# EasyEDA Pro project 3轴6.1--esp32 -(0821).eprj, board PCB
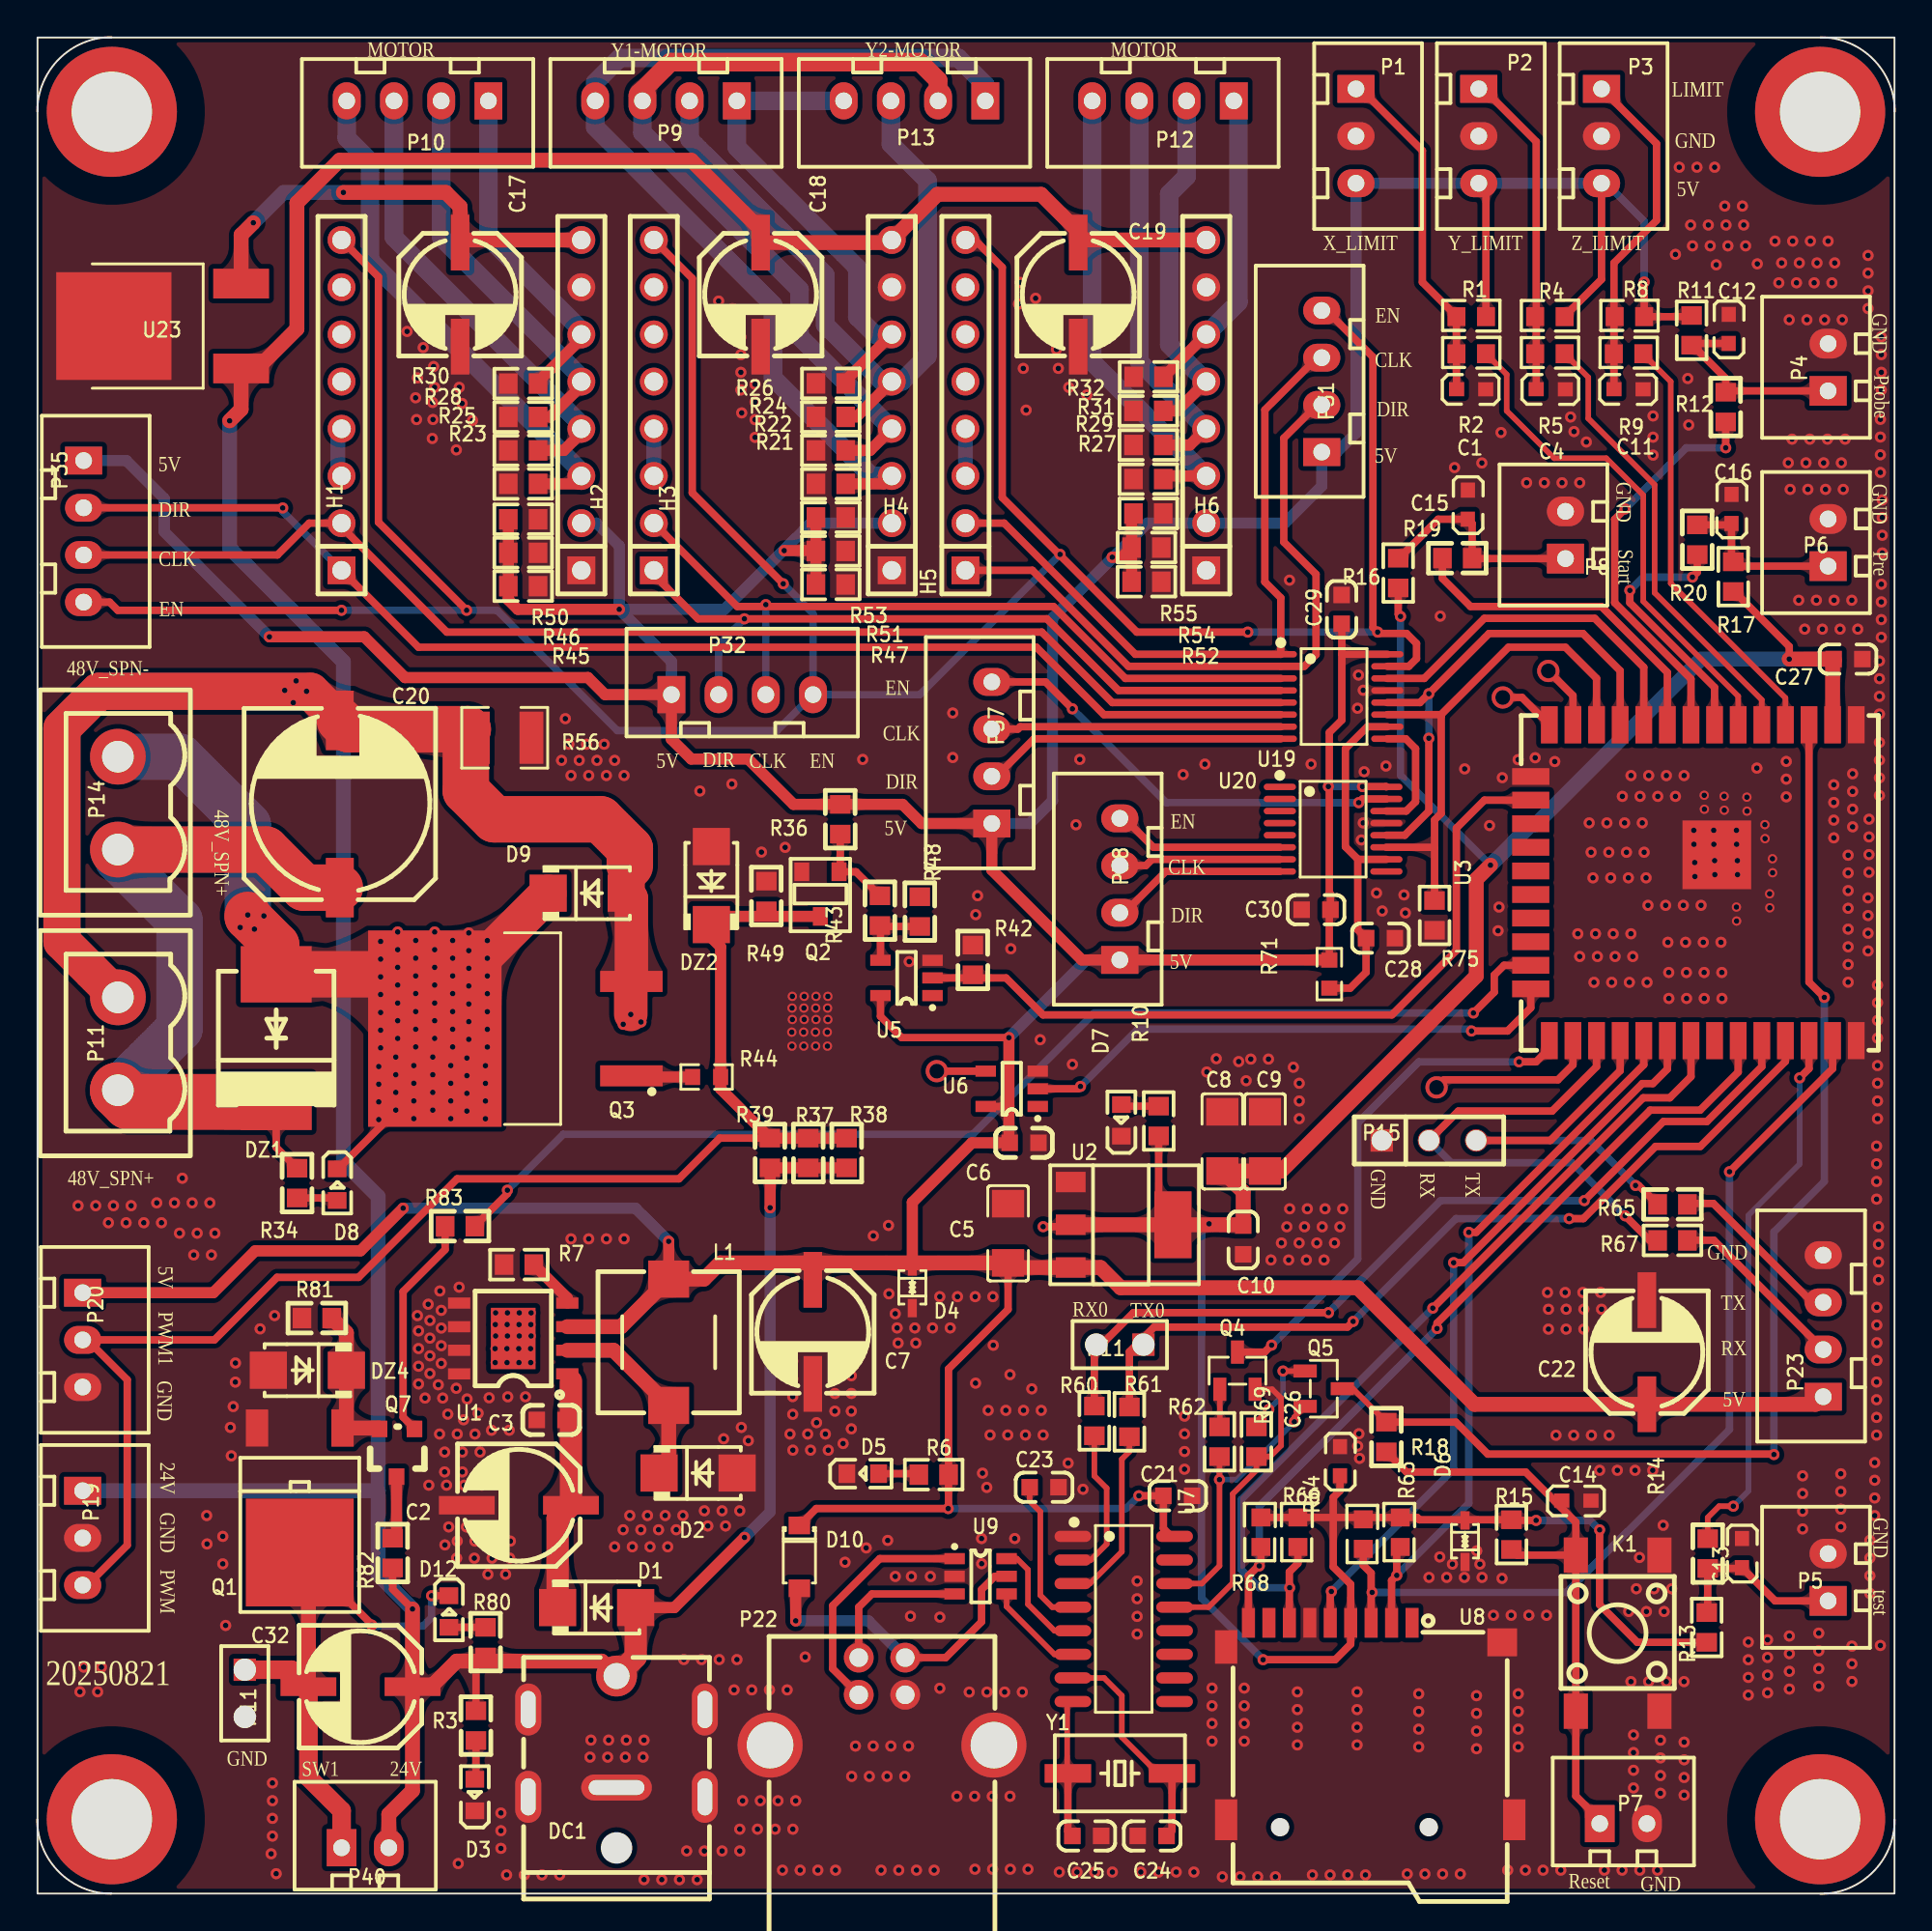
[diagram p1: board, top side]
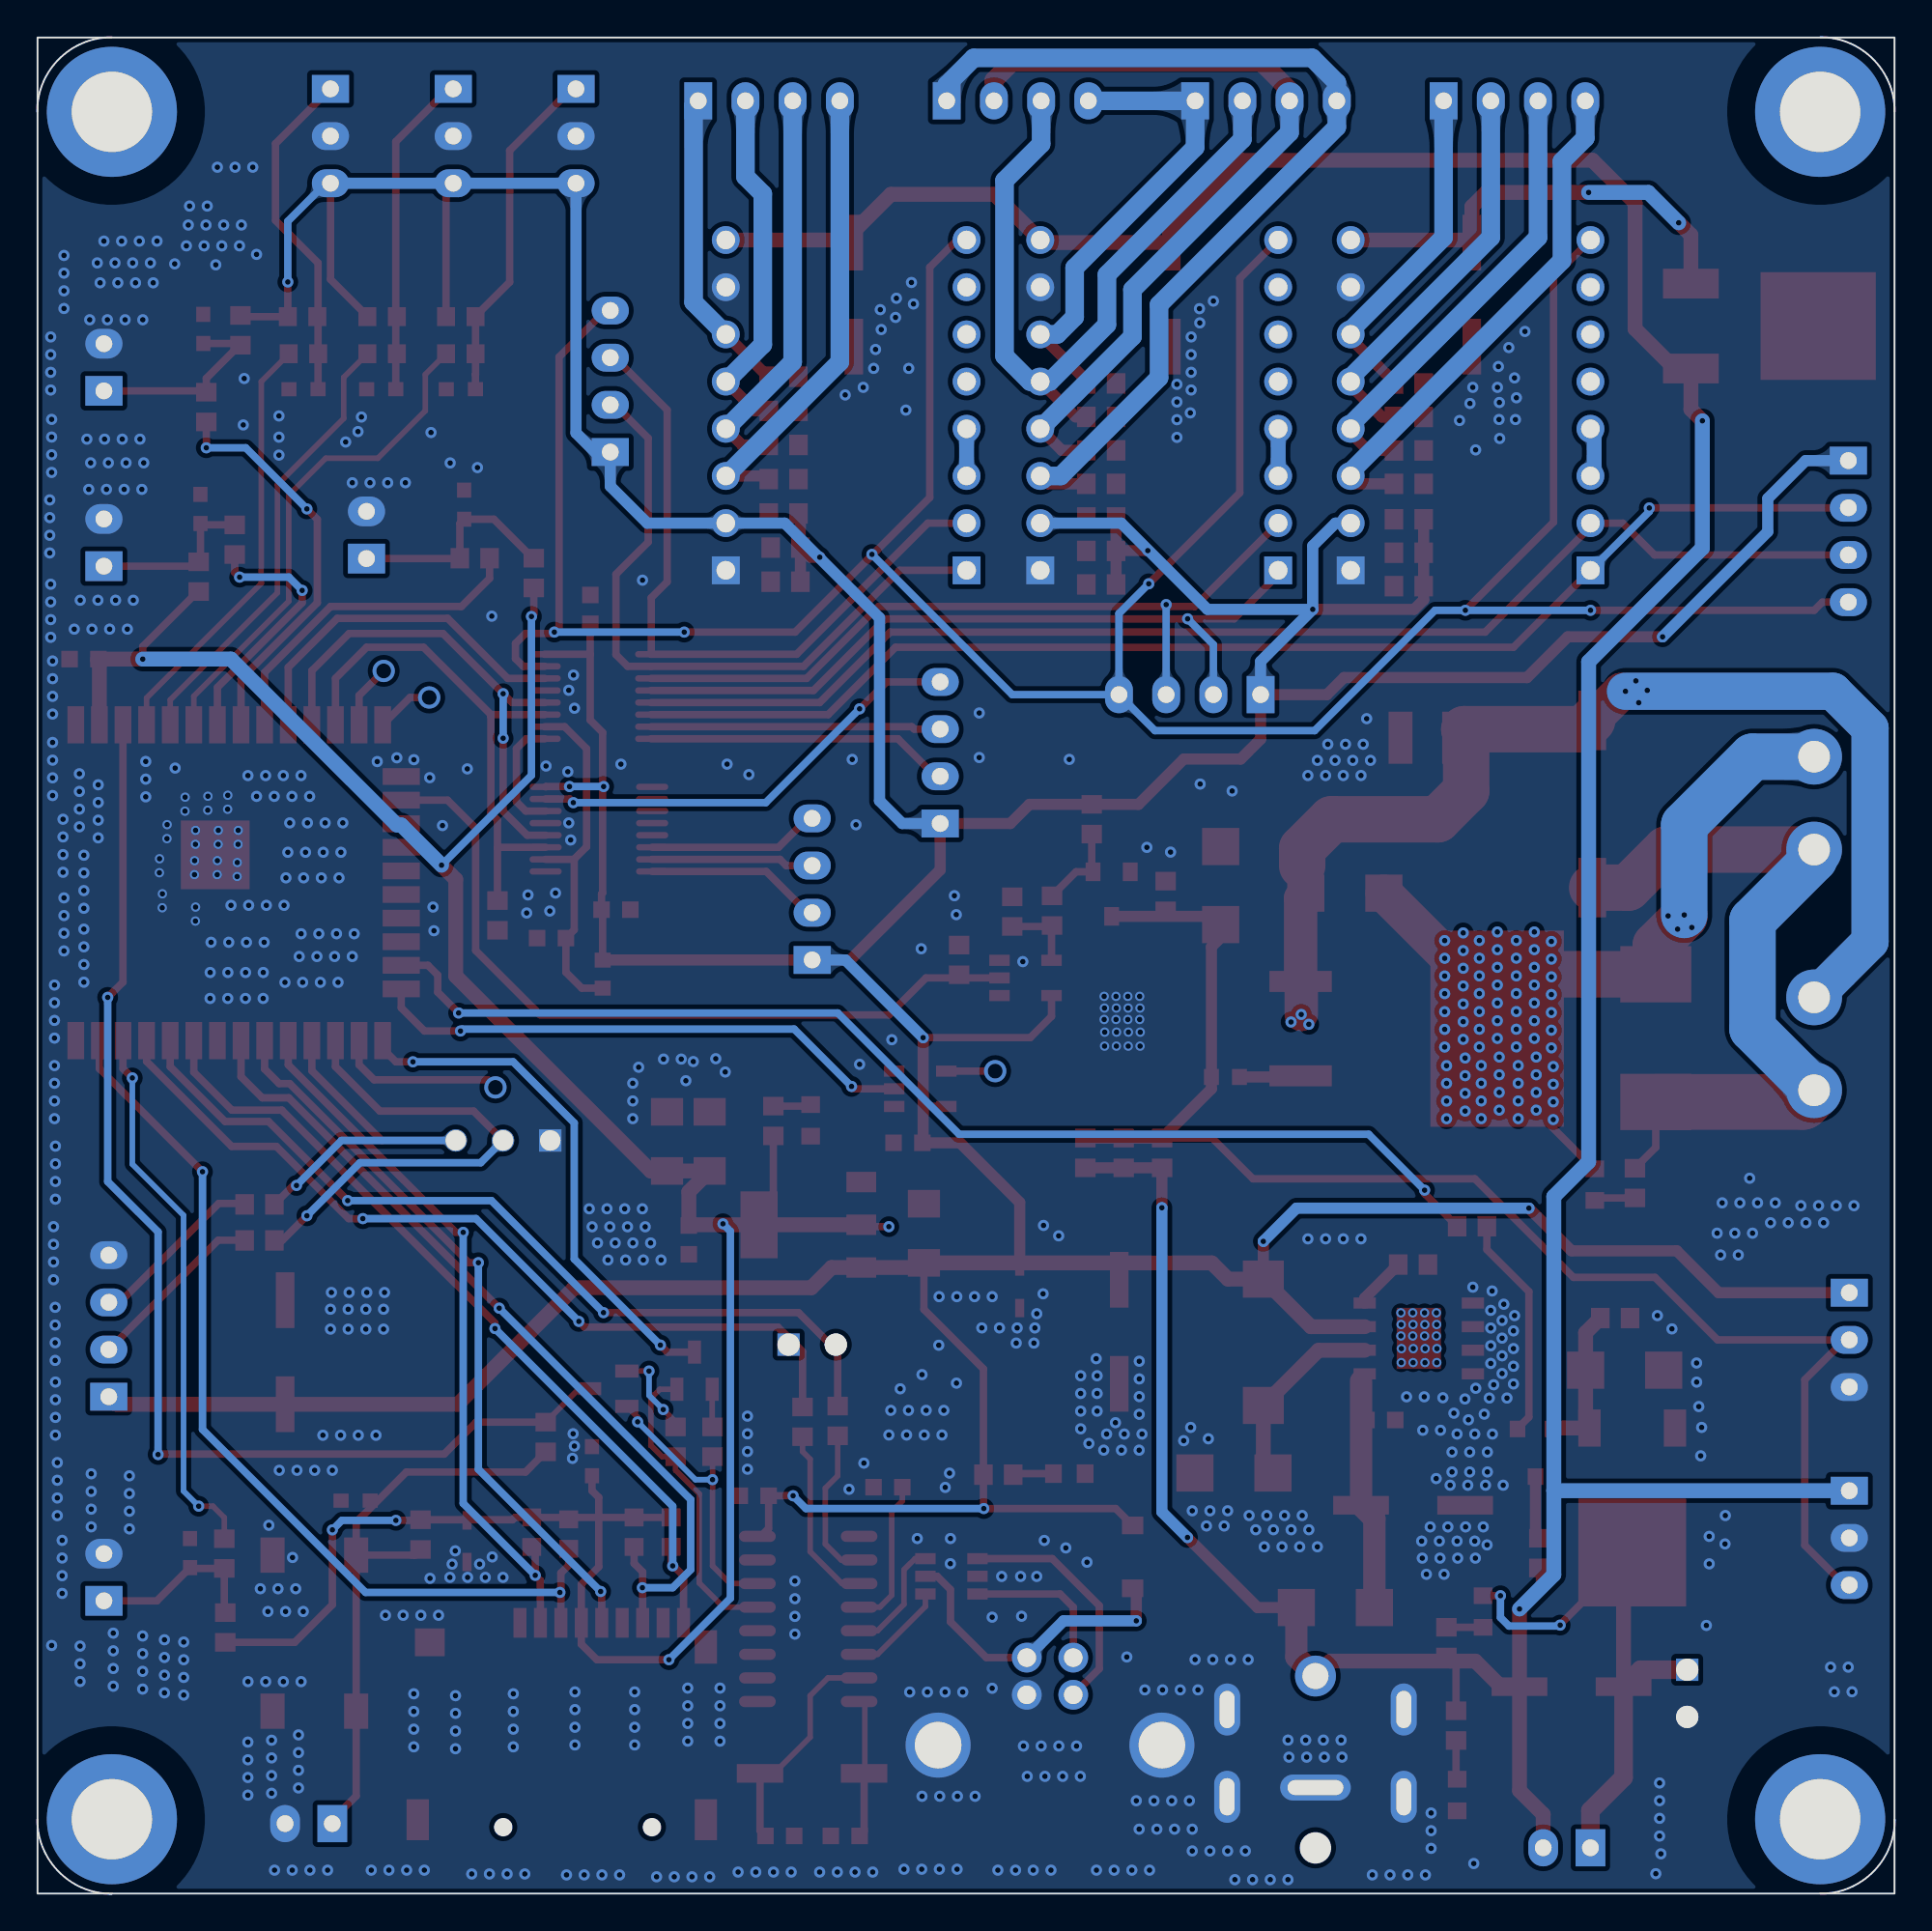
[diagram p2: board, bottom side, seen from below]

Outline 99.94 x 99.94 mm; copper layers: Top Layer, Bottom Layer. Coordinates in mm from the lower left corner of the outline.
Outline path: rectangle 0.02,99.92 99.92,0.02 ; 0.01,95.94 arc(1.18,98.77) 4.01,99.94 ; 4,0.01 arc(1.17,1.18) 0,4.01 ; 95.94,99.93 arc(98.77,98.76) 99.94,95.93 ; 99.93,4 arc(98.76,1.17) 95.93,0
Stack: Top Layer 0.035mm / Dielectric1 1.51mm FR4 er 4.5 / Bottom Layer 0.035mm

## Design rules (mm)
template: 用户自定义配置
spacing Default (default): track to track 0.152, other pairs 0 to 0.152
track width Default (default): min 0.254, default 0.254, max 25.4
differential pair differentialPair (default): width min 0.127, default 0.254, max 2.54; gap min 0.152, default 0.152
via Default (default): diameter min 0.25, default 0.61, max 100.025; hole min 0.2, default 0.305, max 59.995

## Placement (name value [footprint] x y rotation side)
C1  103  [11]  77.88 80.69 0 top
C2  100uF/35V  [电解电容贴片6X6]  25.91 20.92 180 top
C3  104  [0603C]  27.65 25.51 0 top
C4  103  [11]  82.17 80.69 0 top
C5  10uF  [C1206]  52.23 35.55 90 top
C6  104  [0603C]  53.09 40.42 180 top
C7  100uF/35V  [电解电容贴片6X6]  41.72 30.25 270 top
C8  4.7uF  [C1206]  63.76 40.5 270 top
C9  4.7uF  [C1206]  66.05 40.5 270 top
C10  104  [0603C]  64.88 35.2 90 top
C11  103  [11]  86.35 80.69 0 top
C12  103  [11]  91.3 84.97 90 top
C13  103  [11]  92.01 19.08 90 top
C14  103  [11]  83.55 20.87 0 top
C15  103  [11]  77.27 75.51 90 top
C16  103  [11]  91.45 75.28 90 top
C17  100uF/35V(47uF/50V)  [电解电容贴片6X6]  22.75 86.08 270 top
C18  100uF/35V(47uF/50V)  [电解电容贴片6X6]  38.92 86.08 270 top
C19  100uF/35V(47uF/50V)  [电解电容贴片6X6]  56.01 86.08 270 top
C20  100uF/63V  [电解电容贴片10x10]  16.38 58.4 90 top
C21  104  [0603C]  61.36 21.43 0 top
C22  100uF/35V  [电解电容贴片6X6]  86.6 29.15 90 top
C23  104  [0603C]  54.17 21.89 0 top
C24  18pF  [0603C]  59.98 3.12 180 top
C25  18pF  [0603C]  56.46 3.12 0 top
C26  104  [11]  70.39 24.03 90 top
C27  104  [0603C]  97.42 66.46 0 top
C28  104  [0603C]  72.27 51.44 180 top
C29  104  [0603C]  70.18 69.14 90 top
C30  104  [0603C]  68.8 52.97 180 top
C32  100uF/35V  [电解电容贴片6X6]  17.39 11.15 180 top
D1  SS56  [SMA]  30.1 15.41 0 top
D2  SS34  [SMA]  35.55 22.65 0 top
D3  绿光  [0603LED]  23.56 5.29 270 top
D4  PESD5V0L1BA-N  [SOD-323_L1.8-W1.3-LS2.5-BI]  47.08 32.65 90 top
D5  绿光  [0603LED]  44.38 22.6 180 top
D6  PESD3V3L1BA-N  [SOD-323_L1.8-W1.3-LS2.5-BI]  76.81 18.98 90 top
D7  绿光  [0603LED]  58.34 41.6 270 top
D8  绿光  [0603LED]  16.12 38.21 90 top
D9  SS56  [SMA]  29.59 53.86 0 top
D10  1N4148  [SOD-123_L2.8-W1.8-LS3.7-RD]  41 18.14 270 top
D12  绿光  [0603LED]  22.13 15.23 90 top
DC1  DC007B-2.5  [DC-IN-TH_HX-DC007B-2.5]  31.17 8.47 90 top
DZ1  RS5M  [SMC]  12.86 46.06 90 top
DZ2  --ѹ------SMAZ10V  [SMA]  36.27 54.27 90 top
DZ4  --ѹ------SMAZ10V  [SMA]  14.53 28.19 180 top
H1  PZ254V-11-08P  [HDR-TH_8P-P2.54-V-M]  16.37 80.13 90 top
H2  PZ254V-11-08P  [HDR-TH_8P-P2.54-V-M]  29.27 80.13 90 top
H3  PZ254V-11-08P  [HDR-TH_8P-P2.54-V-M]  33.17 80.13 90 top
H4  PZ254V-11-08P  [HDR-TH_8P-P2.54-V-M]  45.97 80.13 90 top
H5  PZ254V-11-08P  [HDR-TH_8P-P2.54-V-M]  49.94 80.13 90 top
H6  PZ254V-11-08P  [HDR-TH_8P-P2.54-V-M]  62.89 80.13 90 top
H11  PZ254V-11-02P  [HDR-TH_2P-P2.54-V-M]  11.17 10.79 270 top
H11#2  -  [HDR-TH_2P-P2.54-V-M]  58.24 29.56 180 top
K1  SW_6X6_H=12.0MM  [KEY-SMD_4P-L6.0-W6.0-P4.50-LS9.0]  85.03 14.03 270 top
L1  68uH  [IND-SMD_L7.0-W7.0_SMDRI74-330MT]  33.97 29.69 270 top
NOREF  -  [Pad_ie51]  4.02 4.02 90 top
NOREF#2  -  [Pad_ie53]  95.92 95.92 90 top
NOREF#3  -  [Pad_ie52]  95.92 4.02 90 top
NOREF#4  -  [Pad_ie50]  4.02 95.92 90 top
P1  3P  [HDR1X3_CON]  70.95 94.61 270 top
P2  3P  [HDR1X3_CON]  77.55 94.61 270 top
P3  3P  [HDR1X3_CON]  84.16 94.61 270 top
P4  2P  [HDR1X2_CON]  96.35 82.17 90 top
P5  2P  [HDR1X2_CON]  96.35 17.04 90 top
P6  2P  [HDR1X2_CON]  96.35 72.73 90 top
P7  2P  [HDR1X2_CON]  85.33 3.78 0 top
P8  2P  [HDR1X2_CON]  82.22 73.14 90 top
P9  4P  [HDR1X4_CON]  37.64 96.51 180 top
P10  4P  [HDR1X4_CON]  24.27 96.51 180 top
P11  WJ2EDGVC-5.08-2P  [CONN-TH_WJ2EDGVC-5.08-2P]  4.34 45.75 90 top
P12  4P  [HDR1X4_CON]  64.37 96.51 180 top
P13  4P  [HDR1X4_CON]  51.01 96.51 180 top
P14  WJ2EDGVC-5.08-2P  [CONN-TH_WJ2EDGVC-5.08-2P]  4.34 58.71 90 top
P15  PZ254V-11-03P  [HDR-TH_3P-P2.54-V-M]  74.88 40.55 0 top
P19  3P  [HDR1X3_CON]  2.45 19.16 270 top
P20  3P  [HDR1X3_CON]  2.45 29.82 270 top
P22  USB-B10-BRW  [USB-B-TH_USB-B10-BRW]  45.45 10.36 0 top
P23  4P  [HDR1X4_CON]  96.09 26.76 90 top
P31  4P  [HDR1X4_CON]  69.11 77.6 90 top
P32  4P  [HDR1X4_CON]  34.12 64.55 0 top
P35  4P  [HDR1X4_CON]  2.5 77.15 270 top
P37  4P  [HDR1X4_CON]  51.36 57.61 90 top
P38  4P  [HDR1X4_CON]  58.24 50.27 90 top
P40  2P  [HDR1X2_CON]  17.65 2.48 0 top
Q1  F50N06 (FR9024N)  [TO-252]  14.13 22.47 180 top
Q2  SS8050  [SOT-23#2]  42.13 53.81 180 top
Q3  KNB2910A  [TO-263-2_L10.0-W9.1-P5.08-LS15.2-TL]  26.68 46.57 180 top
Q4  SS8050  [SOT-23-3_L2.9-W1.3-P1.90-LS2.4-BR]  64.57 28.16 270 top
Q5  SS8050  [SOT-23-3_L2.9-W1.3-P1.90-LS2.4-BR]  69.21 27.19 180 top
Q7  SS8050  [SOT-23]  20.3 25.02 180 top
R1  20K  [10]  76.25 84.78 0 top
R2  100  [10]  76.25 82.78 0 top
R3  47K  [0603R]  23.6 9.05 90 top
R4  20K  [10]  80.49 84.78 0 top
R5  100  [10]  80.49 82.78 0 top
R6  10K  [0603R]  48.23 22.56 0 top
R7  10K  [0603R]  25.91 33.87 180 top
R8  20K  [10]  84.76 84.78 0 top
R9  100  [10]  84.72 82.78 0 top
R10  10K  [0603R]  60.33 41.6 270 top
R11  10K  [0603R]  89 84.16 270 top
R12  100  [0603R]  90.84 80.03 90 top
R13  10K  [0603R]  89.82 14.34 90 top
R14  100  [0603R]  89.87 18.32 270 top
R15  10K  [0603R]  79.31 19.34 270 top
R16  10K  [0603R]  73.22 71.09 90 top
R17  10K  [0603R]  91.25 70.9 90 top
R18  100  [0603R]  72.58 24.59 270 top
R19  100  [0603R]  76.4 71.89 0 top
R20  100  [0603R]  89.31 72.89 90 top
R21  10K  [0603R]  42.69 75.89 180 top
R22  10K  [0603R]  42.69 77.7 180 top
R23  10K  [0603R]  26.15 75.89 180 top
R24  10K  [0603R]  42.69 79.5 180 top
R25  10K  [0603R]  26.15 77.69 180 top
R26  10K  [0603R]  42.69 81.3 180 top
R27  10K  [0603R]  59.78 76.15 180 top
R28  10K  [0603R]  26.15 79.49 180 top
R29  10K  [0603R]  59.78 77.99 180 top
R30  10K  [0603R]  26.15 81.29 180 top
R31  10K  [0603R]  59.78 79.82 180 top
R32  10K  [0603R]  59.79 81.65 180 top
R34  100K  [0603R]  13.98 38.26 90 top
R36  10K  [0603R]  43.2 57.84 90 top
R37  100K  [0603R]  41.48 39.88 270 top
R38  100K  [0603R]  43.55 39.88 270 top
R39  100K  [0603R]  39.42 39.88 270 top
R42  10K  [0603R]  50.34 50.27 90 top
R43  100  [0603R]  45.34 52.92 90 top
R44  100Ω  [R0603]  36.01 43.97 180 top
R45  10K  [0603R]  26.15 70.39 0 top
R46  10K  [0603R]  26.15 72.19 0 top
R47  10K  [0603R]  42.69 70.48 0 top
R48  100  [0603R]  47.48 52.87 270 top
R49  10K  [0603R]  39.23 53.71 90 top
R50  10K  [0603R]  26.15 73.99 0 top
R51  10K  [0603R]  42.69 72.28 0 top
R52  10K  [0603R]  59.68 70.63 0 top
R53  10K  [0603R]  42.69 74.08 0 top
R54  10K  [0603R]  59.68 72.46 0 top
R55  10K  [0603R]  59.78 74.3 0 top
R56  0Ω  [R1210]  25.15 62.23 180 top
R60  510Ω  [0603R]  56.87 25.46 90 top
R61  510Ω  [0603R]  58.76 25.41 90 top
R62  10K  [0603R]  63.6 24.33 90 top
R63  10K  [10]  73.45 18.57 90 top
R64  10K  [10]  71.46 18.47 90 top
R65  510Ω  [0603R]  87.98 37.11 0 top
R66  10K  [10]  67.94 18.57 90 top
R67  510Ω  [0603R]  87.98 35.17 0 top
R68  10K  [10]  65.95 18.57 90 top
R69  10K  [0603R]  65.59 24.33 90 top
R71  10kΩ  [R0603]  69.51 49.5 90 top
R75  10K  [0603R]  75.17 52.66 270 top
R80  100K  [0603R]  24.12 13.55 90 top
R81  10K  [0603R]  15.04 30.99 0 top
R82  50K  [0603R]  19.12 18.34 270 top
R83  2K  [0603R]  22.75 35.94 0 top
U1  XL1509-5.0E1//SXL1509-5.0E1  [ESOP-8_L4.9-W3.9-P1.27-LS6.0-BL-EP]  25.61 29.89 90 top
U2  1117-3.3  [SOT-223]  58.3 36.01 270 top
U3  ESP32-WROOM-32  [WIFI-SMD_ESP32-WROOM-32UE-A]  89.1 54.42 270 top
U5  74LVC1G04  [SOT-23-5]  46.77 49.3 180 top
U6  74LVC1G17  [SOT-23-5]  52.43 43.33 180 top
U7  CH340G  [SOIC-16_L9.9-W3.9-P1.27-LS6.0-BL]  58.45 14.8 270 top
U8  自弹TF卡座TFAA  [SIM-SMD_C9900015645]  71.71 9.29 0 top
U9  USBLC2-2SC6  [SOT-23-6]  50.75 17.09 0 top
U19  74AHCT595T16-13  [TSSOP-16_L5.0-W4.4-P0.65-LS6.4-BL]  69.77 64.45 270 top
U20  74AHCT595T16-13  [TSSOP-16_L5.0-W4.4-P0.65-LS6.4-BL]  69.72 57.31 270 top
U23  CJ7812  [TO-252-2_L6.6-W6.1-P4.57-LS10.1-BR-CW]  7.55 84.39 0 top
Y1  12M  [晶振贴片49SSMD]  58.25 6.48 0 top

## Footprints (pads in the part's own frame, mm; a bottom-side part is the same pattern mirrored in y, then rotated)
10
  rect 0.965x1.016 smd: 1(0.101,0.117) 2(1.688,0.117)
11
  rect 0.813x0.762 smd: 1(0.043,0.296) 2(-1.524,0.301)
0603C
  rect 0.889x0.889 smd: 1(-0.774,0) 2(0.774,0)
0603LED
  rect 0.9x1 smd: 1(-0.884,-0.017) 2(0.816,-0.017)
0603R
  rect 1x1.1 smd: 1(-0.8,0) 2(0.8,0)
C1206
  rect 1.485x1.728 smd: 1(-1.593,0) 2(1.593,0)
CONN-TH_WJ2EDGVC-5.08-2P
  round 3 hole 1.7: 1(-2.499,0) 2(2.499,0)
DC-IN-TH_HX-DC007B-2.5
  round 2.2 hole 1.4: 1(3.25,0)
  oval 1.4x3.8 hole 0.8x3: 2(-2.75,0)
  oval 2.8x1.4 hole 2x0.8: 3(-3.25,4.75) 3(-3.25,-4.75) 3(1.45,4.75) 3(1.45,-4.75)
ESOP-8_L4.9-W3.9-P1.27-LS6.0-BL-EP
  rect 0.6x1.2 smd: 1(-1.905,-2.909) 2(-0.635,-2.909) 3(0.635,-2.909) 4(1.905,-2.909) 5(1.905,2.909) 6(0.635,2.909) 7(-0.635,2.909) 8(-1.905,2.909)
  rect 3.3x2.4 smd: 9(0,0)
HDR1X2_CON
  rect 1.6x2 hole 0.9: 1(-1.27,0)
  oval 1.6x2 hole 0.9: 2(1.27,0)
HDR1X3_CON
  rect 1.5x2 hole 0.9: 1(-2.54,0)
  oval 1.5x2 hole 0.9: 2(0,0) 3(2.54,0)
HDR1X4_CON
  rect 1.5x2 hole 0.9: 1(0,0)
  oval 1.5x2 hole 0.9: 2(2.54,0) 3(5.08,0) 4(7.62,0)
HDR-TH_2P-P2.54-V-M
  rect 1.2x1.2 hole 1.2x0.8: 1(-1.27,0)
  round 1.2 hole 1.2x0.8: 2(1.27,0)
HDR-TH_3P-P2.54-V-M
  rect 1.2x1.2 hole 1.1x0.8: 1(-2.54,0)
  round 1.2 hole 1.1x0.8: 2(0,0) 3(2.54,0)
HDR-TH_8P-P2.54-V-M
  rect 1.5x1.5 hole 1: 1(-8.89,0)
  round 1.5 hole 1: 2(-6.35,0) 3(-3.81,0) 4(-1.27,0) 5(1.27,0) 6(3.81,0) 7(6.35,0) 8(8.89,0)
IND-SMD_L7.0-W7.0_SMDRI74-330MT
  rect 2x2.2 smd: 1(-3.4,0) 2(3.4,0)
KEY-SMD_4P-L6.0-W6.0-P4.50-LS9.0
  rect 1.9x1.3 smd: 1(-4.2,2.25) 2(4.2,2.25) 3(-4.2,-2.25) 4(4.2,-2.25)
Pad_ie50
  round 7 hole 4.32: 0(0,0)
Pad_ie51
  round 7 hole 4.32: 0(0,0)
Pad_ie52
  round 7 hole 4.32: 0(0,0)
Pad_ie53
  round 7 hole 4.32: 0(0,0)
R0603
  rect 0.806x0.864 smd: 1(-0.753,0) 2(0.753,0)
R1210
  rect 1.282x2.808 smd: 1(-1.441,0) 2(1.441,0)
SIM-SMD_C9900015645
  rect 0.7x1.6 smd: 1(2.25,5.3) 2(1.15,5.3) 3(0.05,5.3) 4(-1.05,5.3) 5(-2.15,5.3) 6(-3.25,5.3) 7(-4.35,5.3) 8(-5.45,5.3) 9(-6.55,5.3)
  rect 1.2x1.8 smd: 10(-7.75,4)
  rect 1.6x1.5 smd: 11(7.1,4.25)
  rect 1.2x2.2 smd: 12(-7.75,-5.3) 13(7.75,-5.3)
SMA
  rect 2x2 smd: 1(2.1,0) 2(-2.1,0)
SMC
  rect 3.03x3.82 smd: 1(3.435,0) 2(-3.435,0)
SOD-123_L2.8-W1.8-LS3.7-RD
  rect 0.95x1.15 smd: 1(-1.692,0) 2(1.692,0)
SOD-323_L1.8-W1.3-LS2.5-BI
  rect 0.986x0.49 smd: 1(-1.117,0) 2(1.117,0)
SOIC-16_L9.9-W3.9-P1.27-LS6.0-BL
  oval 0.602x1.971 smd: 1(-4.445,-2.736) 2(-3.175,-2.736) 3(-1.905,-2.736) 4(-0.635,-2.736) 5(0.635,-2.736) 6(1.905,-2.736) 7(3.175,-2.736) 8(4.445,-2.736) 9(4.445,2.736) 10(3.175,2.736) 11(1.905,2.736) 12(0.635,2.736) 13(-0.635,2.736) 14(-1.905,2.736) 15(-3.175,2.736) 16(-4.445,2.736)
SOT-23
  rect 0.838x0.889 smd: 1(0,0) 2(1.879,0) 3(0.965,2.566)
SOT-23#2
  rect 0.8x1 smd: 1(-1,-1.2) 2(0,1.2) 3(1,-1.2)
SOT-23-3_L2.9-W1.3-P1.90-LS2.4-BR
  rect 1.25x0.7 smd: 1(1,-0.95) 2(1,0.95) 3(-1,0)
SOT-23-5
  rect 1.1x0.6 smd: 1(-1.4,0.95) 2(-1.4,0) 3(-1.4,-0.95) 4(1.4,-0.95) 5(1.4,0.95)
SOT-23-6
  rect 1.1x0.6 smd: 1(-1.4,0.95) 2(-1.4,0) 3(-1.4,-0.95) 4(1.4,-0.95) 5(1.4,0) 6(1.4,0.95)
SOT-223
  rect 1.1x1.6 smd: 1(-2.3,-2.7) 2(0,-2.7) 3(2.3,-2.7)
  rect 3.6x2 smd: 4(0,2.8)
TO-252
  rect 1.2x2 smd: 1(-2.3,-2.6) 3(2.3,-2.6)
  rect 5.8x5.8 smd: 2(0,4.1)
TO-252-2_L6.6-W6.1-P4.57-LS10.1-BR-CW
  rect 3x1.6 smd: 1(3.423,-2.285) 3(3.424,2.285)
  rect 6.2x5.8 smd: 2(-3.424,0)
TO-263-2_L10.0-W9.1-P5.08-LS15.2-TL
  rect 3.358x1.134 smd: 1(-5.286,2.54) 3(-5.286,-2.54)
  rect 7.181x10.566 smd: 4(5.286,0)
TSSOP-16_L5.0-W4.4-P0.65-LS6.4-BL
  oval 0.343x1.732 smd: 1(-2.275,-2.866) 2(-1.625,-2.866) 3(-0.975,-2.866) 4(-0.325,-2.866) 5(0.325,-2.866) 6(0.975,-2.866) 7(1.625,-2.866) 8(2.275,-2.866) 9(2.275,2.866) 10(1.625,2.866) 11(0.975,2.866) 12(0.325,2.866) 13(-0.325,2.866) 14(-0.975,2.866) 15(-1.625,2.866) 16(-2.275,2.866)
USB-B-TH_USB-B10-BRW
  round 1.6 hole 1: 1(1.25,2.355) 2(-1.25,2.355) 3(-1.25,0.355) 4(1.25,0.355)
  round 3.5 hole 2.5: 5(-6.02,-2.355) 6(6.02,-2.355)
WIFI-SMD_ESP32-WROOM-32UE-A
  rect 2x0.9 smd: 1(-8.5,8.755) 2(-8.5,7.485) 3(-8.5,6.215) 4(-8.5,4.945) 5(-8.5,3.675) 6(-8.5,2.405) 7(-8.5,1.135) 8(-8.5,-0.135) 9(-8.5,-1.405) 10(-8.5,-2.675) 11(-8.5,-3.945) 12(-8.5,-5.215) 13(-8.5,-6.485) 14(-8.5,-7.755) 25(8.5,-7.755) 26(8.5,-6.485) 27(8.5,-5.215) 28(8.5,-3.945) 29(8.5,-2.675) 30(8.5,-1.405) 31(8.5,-0.135) 32(8.5,1.135) 33(8.5,2.405) 34(8.5,3.675) 35(8.5,4.945) 36(8.5,6.215) 37(8.5,7.485) 38(8.5,8.755)
  rect 0.9x2 smd: 15(-5.715,-8.755) 16(-4.445,-8.755) 17(-3.175,-8.755) 18(-1.905,-8.755) 19(-0.635,-8.755) 20(0.635,-8.755) 21(1.905,-8.755) 22(3.175,-8.755) 23(4.445,-8.755) 24(5.715,-8.755)
  rect 3.7x3.7 smd: 39(-1.5,1.255)
晶振贴片49SSMD
  rect 2.5x1 smd: 1(-2.8,0) 2(2.8,0)
电解电容贴片6X6
  rect 3x1 smd: 1(-2.8,0) 2(2.8,0)
电解电容贴片10x10
  rect 3.2x1.5 smd: 1(-4.242,0.097) 2(4.758,0.097)

## Nets
As in the schematic, except:
GND: C1.1 C2.2 C3.1 C4.1 C5.2 C6.1 C7.2 C8.1 C9.1 C10.1 C11.1 C12.1 C13.1 C14.1 C15.1 C16.1 C17.2 C18.2 C19.2 C21.2 C22.2 C23.2 C24.2 C25.2 C26.1 C27.2 C28.1 C29.2 C30.2 D2.1 D3.2 D4.1 D5.2 D6.1 D7.2 DC1.2 DC1.3 DZ2.1 DZ4.1 H2.1 H2.7 H4.1 H4.7 H6.1 H6.7 H11.2 K1.1 K1.2 P1.2 P2.2 P3.2 P4.2 P5.2 P6.2 P7.2 P8.2 P15.1 P19.2 P20.3 P22.4 P22.5 P22.6 P23.4 Q1.3 Q2.3 R7.2 R21.2 R22.2 R23.2 R24.2 R25.2 R26.2 R27.2 R28.2 R29.2 R30.2 R31.2 R32.2 R42.2 R45.2 R46.2 R47.2 R49.2 R50.2 R51.2 R52.2 R53.2 R54.2 R55.2 R56.1 R75.2 R81.1 U1.5 U1.6 U1.7 U1.8 U2.1 U3.1 U3.15 U3.38 U3.39 U5.3 U6.3 U7.1 U8.6 U8.10 U8.11 U8.12 U8.13 U9.2 U19.13 U20.13 U23.2
RXD: H11#2.2 R60.2 U3.34
TXD: H11#2.1 R61.2 U3.35
$9N121474: C32.2 D12.2 H11.1 P40.1 Q1.2

Pads without a net: NOREF 0; NOREF#2 0; NOREF#3 0; NOREF#4 0; U1 9; U3 17 18 19 20 21 22 32; U5 1; U6 1; U7 9 10 11 12 15; U8 1 8; U20 9

## Via types
v1: diameter 0.5, hole 0.3, Top Layer to Bottom Layer, 66 vias
v2: diameter 0.6, hole 0.3, Top Layer to Bottom Layer, 887 vias
v3: diameter 1.2, hole 0.8, Top Layer to Bottom Layer, 4 vias

## Routing (per net, layer and track width the routed paths; a pad name or vN(x,y) marks a point on that pad's centre or on a via; arc(x,y) is an arc through that point)
3V3: length 160.8
  Top Layer w0.4: R16.1 73.22,68.88 v2(73.35,68.76) ; v2(84.06,19.59) 84.06,15.56 86.08,13.54 R13.1 ; v2(54.12,35.91) 55.5,35.91 U2.2 ; U2.4 60.33,36.78 R10.2 ; v2(65.95,12.6) 69.83,12.6 70.66,13.44 U8.4 70.66,16.66 69.72,17.6 69.72,20.26 ; v2(80.64,20.1) 79.35,20.1 79.31,20.14 74.36,20.14 74.24,20.26 R63.2 69.72,20.26 ; 69.72,20.26 R66.2 R68.2 ; 69.72,20.26 69.72,21.34 70.09,21.7 C26.2 ; v2(94.26,66.46) 94.26,67.14 91.3,70.1 R17.1
  Top Layer w0.8: v2(94.26,66.46) C27.1 ; U2.2 U2.4 64.84,36.01 ; v2(78.18,55.37) 77.42,54.6 77.42,49.4 66.93,38.91 C9.2 C8.2 64.88,37.79 C10.2 ; 96.69,66.41 96.59,66.3 U3.2
  Bottom Layer w0.4: v2(84.06,19.59) 83.55,20.1 v2(80.64,20.1) ; v2(65.95,12.6) 62.64,15.91 62.64,35.66 v2(63.04,36.06) ; v2(73.35,68.76) 73.35,60.21 v2(78.18,55.37)
  Bottom Layer w0.8: v2(94.26,66.46) 89.51,66.46 80.59,57.54 80.35,57.54 v2(78.18,55.37)
5V_VCC: length 422.2
  Top Layer w0.4: R11.1 88.94,84.89 R8.2 86.45,86.76 ; U7.16 61.01,19.24 60.59,19.67 C21.1 v2(59.27,21.43) ; U5.5 45.37,47.23 46.51,46.09 v2(52.28,46.09) ; v2(71.3,59.6) 72.56,59.6 U20.16 ; P3.3 84.16,86.9 82.17,84.92 R4.2 ; P2.3 77.94,91.68 R1.2 ; U6.5 52.26,42.38 52.28,42.39 ; D10.1 41.91,20.74 v2(49.01,20.74) 49.03,20.76 R6.2 49.03,28.25 52.23,31.46 C5.1 ; 70.19,66.72 70.19,66.72 72.63,66.72 ; 70.19,66.72 70.19,68.37 ; 70.19,66.72 70.19,63.18 69.51,62.51 69.51,53.88 69.57,53.82 C30.1 69.51,52.91 R71.2
  Top Layer w0.6: v2(40.19,72.3) 41.88,72.3 41.89,72.28 ; R55.1 58.88,74.2 R54.1 ; 41.89,72.28 41.89,74.08 ; 41.89,72.28 41.89,70.48 ; P20.1 9.48,32.36 11.73,34.61 17.39,34.61 v2(19.69,36.91) ; R54.1 58.36,71.94 v2(57.83,71.94) ; R54.1 R52.1 ; v2(31.31,69.14) 25.86,69.14 25.35,69.65 R45.1 R46.1 R50.1 ; v2(52.28,46.09) 52.28,40.47 52.32,40.42 50.29,40.42 47.08,37.22 D4.2 ; L1.1 v2(33.97,35.12) ; 69.51,50.36 69.42,50.27 P38.1 56.2,50.27 51.36,55.11 P37.1 47.58,57.61 46.55,58.64 R36.2 40.69,58.64 38.25,61.08 35.19,61.08 34.12,62.15 P32.1 30.55,64.55 29.63,65.47 19.79,65.47 17.59,67.66 v2(12.49,67.66)
  Top Layer w0.8: U1.3 31.41,30.53 L1.1 35.87,33.09 36.75,33.96 C5.1 52.48,33.71 U2.3 57.2,33.71 58.29,32.62 71.04,32.62 77.32,26.35 95.68,26.35 P23.1
  Bottom Layer w0.4: v2(59.27,21.43) 58.58,20.74 v2(49.01,20.74) ; v2(86.45,86.76) 86.45,90.03 84.41,92.07 P3.3 ; v2(71.3,59.6) v2(69.46,59.6)
  Bottom Layer w0.6: v2(31.31,69.14) 31.31,72.56 30.09,73.78 H2.2 ; v2(31.31,69.14) 34.12,66.33 P32.1 ; v2(31.31,69.14) 36.97,69.14 41.62,73.78 H4.2 ; P3.3 P2.3 P1.3 70.95,78.63 69.92,77.6 P31.1 69.11,75.77 67.12,73.78 H6.2 59.72,73.78 54.62,68.68 54.62,58.84 53.4,57.61 P37.1 ; v2(52.28,46.09) 56.46,50.27 P38.1 ; v2(33.97,35.12) 32.19,36.91 v2(19.69,36.91) ; P35.1 4.79,77.15 6.83,75.11 6.83,73.32 v2(12.49,67.66)
12V_DIV: length 24.4
  Top Layer w0.8: v2(11.63,89.95) 10.97,89.29 U23.3 ; v2(16.47,91.58) 21.98,91.58 22.75,90.81 C17.1 22.89,89.02 29.5,89.02
  Bottom Layer w0.8: v2(16.47,91.58) 13.26,91.58 v2(11.63,89.95)
24V: length 219.5
  Top Layer w0.4: R80.1 23.6,12.23 23.6,9.85 ; v2(20.19,15.33) 19.12,16.4 R82.2
  Top Layer w0.6: v2(39.43,36.93) 39.43,39.06 R39.2 R37.2 R38.2 ; v2(38.05,19.18) 34.28,15.41 D1.1
  Top Layer w0.8: v2(10.35,79.29) 10.97,79.91 U23.1 11.84,82.1 13.97,84.23 13.97,91.02 16.27,93.31 35.19,93.31 38.92,89.58 C18.1 45.84,88.88 H4.8 48.43,91.48 54.01,91.48 56.01,89.48 C19.1 56.14,89.02 H6.8 ; C32.1 21.19,11.15 22.57,12.53 30.36,12.53 DC1.1 ; C32.1 20.19,5.56 18.92,4.28 P40.2 ; C32.1 v2(20.19,15.33)
  Top Layer w1.2: DC1.1 32.2,12.75 D1.1
  Bottom Layer w0.6: v2(38.05,19.18) 39.43,20.56 v2(39.43,36.93)
  Bottom Layer w0.8: v2(10.35,79.29) 10.35,72.44 16.47,66.32 16.47,39.4 18.35,37.53 18.35,21.71 ; P19.1 18.34,21.7 18.35,21.71 ; 18.35,21.71 18.35,17.18 v2(20.19,15.33)
48V_SPN+: length 41.3
  Top Layer w0.4: R34.2 12.86,40.18 DZ1.2
  Top Layer w2.5: C20.1 14.35,54.16 12.3,56.21 P14.1
  Top Layer w3: P11.1 4.97,42.62 DZ1.2
  Bottom Layer w2.5: P14.1 4.34,55.7 7.66,52.38 7.66,46.57 P11.1
48V_SPN-: length 90
  Top Layer w1.8: D9.1 31.97,53.58 31.97,49.11 31.93,49.08 v2(31.93,47.33)
  Top Layer w2: P11.2 1.33,51.26 1.33,62.74 3.32,64.73 14.71,64.73 C20.2
  Top Layer w2.5: C20.2 16.75,62.69 23.16,62.69 23.06,62.58 23.06,59.37 24.59,57.84 30.3,57.84 31.88,56.26 31.88,55.34
  Bottom Layer w2: P11.2 1.33,51.26 1.33,62.74 3.32,64.73 v2(14.49,64.73)
  vias: v2(13.32,64.78) v2(13.78,64.11) v2(13.93,65.29) v2(31.53,46.8) v2(32.48,46.93)
GND:
  vias: v1(40.62,48.31) v1(40.61,47.68) v1(40.62,47.06) v1(40.6,46.38) v1(40.6,45.63) v1(41.23,46.38) v1(41.26,48.31) v1(41.25,47.68) v1(41.26,47.06) v1(41.24,45.63) v1(41.9,48.31) v1(41.88,47.68) v1(41.9,47.06) v1(41.87,46.38) v1(41.88,45.63) v1(42.54,48.31) v1(42.52,47.68) v1(42.54,47.06) v1(42.51,46.38) v1(42.51,45.63) v1(89.12,57.24) v1(89.13,56.49) v1(89.17,55.51) v1(89.18,54.76) v1(89.68,59.13) v1(89.69,58.38) v1(90.19,57.24) v1(90.2,56.49) v1(90.24,55.61) v1(90.25,54.86) v1(90.75,59.08) v1(90.76,58.33) v1(91.42,57.24) v1(91.42,56.49) v1(91.42,53.11) v1(91.42,52.36) v1(91.47,55.61) v1(91.48,54.86) v1(91.98,59.03) v1(91.99,58.28) v1(92.95,57.55) v1(92.95,56.8) v1(93.2,53.83) v1(93.21,53.07) v1(93.35,55.71) v1(93.36,54.96) v2(2.2,37.04) v2(2.3,10.88) v2(2.5,12.2) v2(3.15,37.04) v2(3.25,10.88) v2(3.46,12.2) v2(3.83,36.12) v2(4.1,37.04) v2(4.78,36.12) v2(5.06,37.04) v2(5.73,36.12) v2(6.43,37.19) v2(6.69,36.12) v2(7.38,37.19) v2(7.66,35.56) v2(7.81,38.52) v2(8.34,37.19) v2(8.42,34.39) v2(8.61,35.56) v2(9.12,20.36) v2(9.14,18.83) v2(9.29,37.19) v2(9.37,34.39) v2(9.56,35.56) v2(9.98,19.24) v2(9.98,17.76) v2(10.14,14.45) v2(10.39,25.11) v2(10.44,23.58) v2(10.55,26.23) v2(10.67,28.57) v2(10.66,27.54) v2(11.99,30.41) v2(12.59,2.16) v2(12.66,5.97) v2(12.66,5.01) v2(12.66,4.06) v2(12.66,3.11) v2(12.77,31.12) v2(12.86,1.08) v2(19.9,84.1) v2(20.36,80.53) v2(20.41,79.35) v2(20.46,81.6) v2(20.46,31.12) v2(20.52,30.3) v2(20.52,29.35) v2(20.52,28.4) v2(20.52,27.45) v2(20.77,83.23) v2(20.86,26.69) v2(21.03,31.74) v2(21.13,30.86) v2(21.13,29.91) v2(21.13,28.96) v2(21.13,28.01) v2(21.07,21.99) v2(21.33,82.21) v2(21.28,80.27) v2(21.29,79.36) v2(21.26,78.34) v2(21.38,81.09) v2(21.58,27.4) v2(21.66,32.45) v2(21.65,24.75) v2(21.74,31.41) v2(21.74,30.45) v2(21.74,29.5) v2(21.74,28.55) v2(21.82,26.69) v2(21.92,23.78) v2(21.92,22.71) v2(21.94,18.78) v2(22.02,21.99) v2(22.09,25.82) v2(22.14,19.75) v2(22.55,77.72) v2(22.55,27.21) v2(22.6,24.75) v2(22.6,18.99) v2(22.56,18.07) v2(22.7,81.09) v2(22.7,32.65) v2(22.65,1.63) v2(22.86,80.22) v2(22.87,23.78) v2(22.87,22.71) v2(22.94,25.51) v2(22.97,21.99) v2(23.13,26.64) v2(23.09,19.75) v2(23.42,79.3) v2(23.52,18.07) v2(23.55,24.75) v2(23.55,18.99) v2(23.72,25.87) v2(23.82,23.78) v2(23.82,22.71) v2(23.92,21.99) v2(24.04,19.75) v2(24.31,26.7) v2(24.25,17.2) v2(24.44,24.95) v2(24.5,18.99) v2(24.47,18.07) v2(24.67,22.35) v2(25,19.75) v2(24.95,4.35) v2(24.95,3.4) v2(24.95,2.45) v2(25.2,17.2) v2(25.32,26.75) v2(25.25,1.02) v2(25.39,24.95) v2(25.42,18.07) v2(25.46,18.99) v2(26.21,1.02) v2(26.27,26.75) v2(27.16,1.02) v2(28.11,1.02) v2(28.21,61.01) v2(28.41,63.25) v2(28.6,61.88) v2(28.72,60.19) v2(28.72,35.25) v2(29.16,61.01) v2(29.55,61.88) v2(29.67,60.19) v2(29.67,35.25) v2(29.79,8.28) v2(29.74,7.36) v2(30.11,61.01) v2(30.5,61.88) v2(30.62,60.19) v2(30.62,35.25) v2(30.69,7.36) v2(30.74,8.28) v2(31.06,61.01) v2(31.06,18.68) v2(31.52,19.6) v2(31.57,60.19) v2(31.57,35.25) v2(31.69,8.28) v2(31.64,7.36) v2(31.88,20.36) v2(32.02,18.68) v2(32.48,19.6) v2(32.59,7.36) v2(32.65,8.28) v2(32.65,0.76) v2(32.83,20.36) v2(32.97,18.68) v2(33.43,19.6) v2(33.6,0.76) v2(33.78,20.36) v2(33.92,18.68) v2(34.38,19.6) v2(34.55,0.76) v2(34.74,20.36) v2(34.79,12.61) v2(34.94,2.31) v2(35.5,0.76) v2(35.65,59.36) v2(35.74,12.61) v2(35.89,20.62) v2(35.89,2.31) v2(36.08,19.8) v2(36.66,85.73) v2(36.69,12.61) v2(36.93,24.49) v2(36.84,20.62) v2(36.84,2.31) v2(37.03,19.8) v2(37.41,85.32) v2(37.39,84.56) v2(37.37,59.74) v2(37.49,10.98) v2(37.64,12.61) v2(37.8,20.62) v2(37.8,3.48) v2(37.8,2.31) v2(37.86,83.8) v2(37.86,82.85) v2(37.86,81.9) v2(37.86,80.95) v2(37.9,79.71) v2(37.88,25.11) v2(37.95,5.01) v2(38.26,24.39) v2(38.44,10.98) v2(38.62,81.25) v2(38.62,80.3) v2(38.62,79.35) v2(38.62,78.4) v2(38.75,3.48) v2(38.9,5.01) v2(38.96,56.07) v2(39.4,10.98) v2(39.7,3.48) v2(39.85,5.01) v2(40.09,1.27) v2(40.24,56.33) v2(40.35,10.98) v2(40.5,24.75) v2(40.65,28.67) v2(40.65,27.72) v2(40.65,26.76) v2(40.65,25.81) v2(40.65,23.88) v2(40.65,3.48) v2(40.81,5.01) v2(41.05,1.27) v2(41.32,12.75) v2(41.45,24.75) v2(41.61,23.88) v2(41.93,25.36) v2(42,1.27) v2(42.4,24.75) v2(42.56,23.88) v2(42.91,27.89) v2(42.91,26.93) v2(42.91,25.98) v2(42.97,28.8) v2(42.95,1.27) v2(43.36,24.24) v2(43.46,17.85) v2(43.8,27.89) v2(43.8,26.93) v2(43.8,25.98) v2(43.8,25.03) v2(43.82,6.32) v2(44.02,7.96) v2(44.41,61.06) v2(44.6,18.62) v2(44.77,6.32) v2(44.98,35.42) v2(44.97,7.96) v2(45.4,1.27) v2(45.72,6.32) v2(45.8,35.98) v2(45.82,32.3) v2(45.76,19.02) v2(45.93,7.96) v2(46.16,31.23) v2(46.16,17.08) v2(46.26,30.46) v2(46.31,29.64) v2(46.35,1.27) v2(46.67,6.32) v2(46.91,50.18) v2(46.88,7.96) v2(47.03,17.08) v2(46.98,14.94) v2(47.22,30.46) v2(47.27,29.64) v2(47.3,1.27) v2(48.05,17.08) v2(48.17,30.46) v2(48.25,1.27) v2(48.56,32.14) v2(48.56,14.89) v2(48.56,11.07) v2(49.12,30.46) v2(49.26,63.56) v2(49.26,61.16) v2(49.51,32.14) v2(49.48,5.25) v2(50.14,10.86) v2(50.43,5.25) v2(50.49,52.71) v2(50.46,32.14) v2(50.48,27.49) v2(50.45,1.33) v2(50.59,53.73) v2(50.8,19.12) v2(50.81,17.77) v2(50.86,22.64) v2(51.09,21.88) v2(51.09,10.86) v2(51.16,26.02) v2(51.26,24.7) v2(51.41,32.14) v2(51.43,29.53) v2(51.38,5.25) v2(51.4,1.33) v2(52.11,26.02) v2(52.05,10.86) v2(52.21,24.7) v2(52.33,27.95) v2(52.33,5.25) v2(52.38,50.87) v2(52.35,1.33) v2(52.59,19.12) v2(52.79,85.58) v2(52.9,86.73) v2(53,10.86) v2(53.05,82.11) v2(53.06,26.02) v2(53.2,79.86) v2(53.17,24.7) v2(53.3,1.33) v2(53.51,27.18) v2(53.71,85.88) v2(53.76,84.85) v2(53.96,45.97) v2(54.02,26.02) v2(54.12,24.7) v2(54.53,84.2) v2(54.58,85.27) v2(54.83,83.13) v2(54.94,82.11) v2(54.99,1.17) v2(55.5,81.09) v2(55.46,23.19) v2(55.69,44.65) v2(55.89,57.54) v2(55.94,1.17) v2(56.09,61.06) v2(56.26,21.78) v2(56.47,80.68) v2(56.89,1.17) v2(57.84,1.17) v2(59.17,16.84) v2(59.17,15.89) v2(59.17,14.93) v2(59.17,13.98) v2(59.37,1.17) v2(60.32,1.17) v2(61.28,1.17) v2(61.65,60.25) v2(61.72,25.71) v2(61.72,24.76) v2(61.72,23.81) v2(61.72,22.86) v2(62.23,1.17) v2(62.82,60.81) v2(62.92,44.24) v2(63.2,11.07) v2(63.2,10.12) v2(63.2,9.17) v2(63.2,8.22) v2(63.43,44.95) v2(63.76,0.92) v2(64.64,44.8) v2(64.71,0.92) v2(64.94,11.07) v2(64.94,10.12) v2(64.94,9.17) v2(64.94,8.22) v2(65.04,43.77) v2(65.29,44.93) v2(65.66,0.92) v2(66.24,44.93) v2(66.37,34.12) v2(66.61,0.92) v2(66.94,35.03) v2(67.23,35.9) v2(67.33,34.12) v2(67.37,70.71) v2(67.38,36.87) v2(67.58,44.49) v2(67.79,10.87) v2(67.79,9.92) v2(67.79,8.97) v2(67.79,8.01) v2(67.9,43.63) v2(67.9,42.68) v2(67.9,41.73) v2(67.89,35.03) v2(68.18,35.9) v2(68.33,36.87) v2(68.28,34.12) v2(68.53,60.81) v2(68.6,1.02) v2(68.84,35.03) v2(69.13,35.9) v2(69.23,34.12) v2(69.28,36.87) v2(69.56,1.02) v2(69.79,35.03) v2(70.08,35.9) v2(70.24,36.87) v2(70.51,1.02) v2(71.03,63.82) v2(71.04,24.1) v2(71.01,10.87) v2(71.01,9.92) v2(71.01,8.97) v2(71.01,8.01) v2(71.08,65.6) v2(71.1,24.77) v2(71.24,56.73) v2(71.14,23.44) v2(71.34,64.78) v2(71.39,60.4) v2(71.34,57.64) v2(71.46,1.02) v2(72.05,53.87) v2(72.36,52.9) v2(72.56,60.7) v2(73.53,53.77) v2(73.6,52.8) v2(73.7,1.07) v2(74.32,10.77) v2(74.32,9.82) v2(74.32,8.86) v2(74.32,7.91) v2(74.66,1.07) v2(74.88,17.03) v2(75.48,68.77) v2(75.46,18.14) v2(75.61,1.07) v2(75.83,17.03) v2(76.14,17.75) v2(76.25,76.77) v2(76.56,1.07) v2(76.8,60.55) v2(76.78,17.03) v2(77.43,10.67) v2(77.43,9.71) v2(77.43,8.76) v2(77.43,7.81) v2(77.44,18.46) v2(77.61,17.75) v2(77.72,77.02) v2(77.73,17.03) v2(78.13,57.5) v2(78.34,14.99) v2(78.59,51.84) v2(78.64,53.11) v2(78.75,78.66) v2(78.82,60.08) v2(78.8,16.98) v2(79.11,1.27) v2(79.3,14.99) v2(79.67,61.05) v2(79.68,10.77) v2(79.68,9.82) v2(79.68,8.86) v2(79.68,7.91) v2(80.13,75.95) v2(80.06,1.27) v2(80.25,14.99) v2(80.59,61.15) v2(81.01,1.27) v2(81.08,75.95) v2(81.2,14.99) v2(81.25,32.37) v2(81.3,31.47) v2(81.3,30.4) v2(81.64,60.95) v2(81.71,24.68) v2(82.03,75.95) v2(81.97,1.27) v2(82.2,32.37) v2(82.25,31.47) v2(82.25,30.4) v2(82.49,79.49) v2(82.68,78.71) v2(82.66,24.68) v2(82.88,51.68) v2(82.98,75.95) v2(82.98,50.45) v2(83.16,32.37) v2(83.21,31.47) v2(83.21,30.4) v2(83.34,78.15) v2(83.49,57.64) v2(83.6,56.06) v2(83.62,24.68) v2(83.7,54.69) v2(83.83,51.68) v2(83.75,49.06) v2(83.94,50.45) v2(84.11,32.37) v2(84.06,22.8) v2(84.16,31.47) v2(84.16,30.4) v2(84.31,1.27) v2(84.45,57.64) v2(84.55,56.06) v2(84.57,24.68) v2(84.65,54.69) v2(84.7,49.06) v2(84.79,51.68) v2(84.89,50.45) v2(85.01,22.8) v2(85.28,59.07) v2(85.26,1.27) v2(85.4,57.64) v2(85.5,56.06) v2(85.6,54.69) v2(85.62,15.2) v2(85.66,49.06) v2(85.74,60.19) v2(85.74,51.68) v2(85.74,11.42) v2(85.84,50.45) v2(85.88,8.56) v2(85.88,7.6) v2(85.88,6.65) v2(85.88,5.7) v2(85.96,22.8) v2(86.03,16.42) v2(86.23,59.07) v2(86.2,18.1) v2(86.22,1.27) v2(86.35,57.64) v2(86.45,56.06) v2(86.55,54.69) v2(86.61,49.06) v2(86.57,15.2) v2(86.7,60.19) v2(86.66,53.21) v2(86.69,11.42) v2(86.93,79.55) v2(86.93,78.41) v2(86.93,77.44) v2(86.91,22.8) v2(86.98,16.42) v2(87.18,59.07) v2(87.17,1.27) v2(87.33,8.27) v2(87.33,7.32) v2(87.33,6.37) v2(87.33,5.41) v2(87.47,19.84) v2(87.53,15.2) v2(87.61,53.21) v2(87.65,60.19) v2(87.73,51.22) v2(87.64,11.42) v2(87.77,49.59) v2(87.78,48.19) v2(87.93,16.42) v2(88.13,88.24) v2(88.13,59.07) v2(88.34,92.94) v2(88.6,60.19) v2(88.56,53.21) v2(88.6,11.42) v2(88.6,8.17) v2(88.6,7.22) v2(88.6,6.26) v2(88.6,5.31) v2(88.68,51.22) v2(88.72,49.59) v2(88.73,48.19) v2(88.8,81.56) v2(88.85,79.06) v2(88.95,89.83) v2(89.05,88.7) v2(89.29,92.94) v2(89.51,53.21) v2(89.63,51.22) v2(89.68,49.59) v2(89.68,48.19) v2(89.9,89.83) v2(90,88.7) v2(90.24,92.94) v2(90.33,87.68) v2(90.58,51.22) v2(90.63,49.59) v2(90.64,48.19) v2(90.79,90.85) v2(90.85,89.83) v2(90.96,88.7) v2(91.74,90.85) v2(91.81,89.83) v2(91.91,88.7) v2(92.05,13.55) v2(92.05,12.6) v2(92.05,11.65) v2(92.05,10.7) v2(92.51,60.59) v2(92.54,87.73) v2(93.09,13.68) v2(93.09,12.72) v2(93.09,11.77) v2(93.09,10.82) v2(93.49,88.96) v2(93.69,86.71) v2(93.85,87.79) v2(94.1,60.95) v2(94.1,60) v2(94.1,59.05) v2(94.2,77.02) v2(94.25,84.73) v2(94.31,75.6) v2(94.26,13.88) v2(94.26,12.93) v2(94.26,11.98) v2(94.26,11.02) v2(94.41,78.3) v2(94.44,88.96) v2(94.65,86.71) v2(94.8,87.79) v2(94.76,69.63) v2(94.98,22.5) v2(94.98,21.55) v2(94.98,20.59) v2(94.98,19.64) v2(95.09,68.07) v2(95.21,84.73) v2(95.16,77.02) v2(95.26,75.6) v2(95.39,88.96) v2(95.36,78.3) v2(95.6,86.71) v2(95.72,69.63) v2(95.75,87.79) v2(95.84,14.03) v2(95.84,13.08) v2(95.84,12.13) v2(95.84,11.18) v2(96.11,77.02) v2(96.04,68.07) v2(96.16,84.73) v2(96.21,75.6) v2(96.31,78.3) v2(96.35,88.96) v2(96.55,86.71) v2(96.7,87.79) v2(96.67,69.63) v2(96.65,59.7) v2(96.65,58.74) v2(96.65,57.79) v2(96.65,56.84) v2(96.99,68.07) v2(97.03,22.61) v2(97.03,21.66) v2(97.03,20.71) v2(97.03,19.75) v2(97.11,84.73) v2(97.06,77.02) v2(97.16,75.6) v2(97.26,78.3) v2(97.43,55.9) v2(97.43,54.95) v2(97.43,54) v2(97.43,53.05) v2(97.43,51.93) v2(97.43,50.97) v2(97.43,50.02) v2(97.43,49.07) v2(97.62,69.63) v2(97.63,13.34) v2(97.63,12.38) v2(97.63,11.43) v2(97.67,60.29) v2(97.67,59.34) v2(97.67,58.38) v2(97.67,57.43) v2(97.94,68.07) v2(98.5,88.19) v2(98.5,87.24) v2(98.5,86.28) v2(98.5,85.33) v2(98.5,53.61) v2(98.5,52.66) v2(98.5,51.7) v2(98.5,50.75) v2(98.55,57.84) v2(98.55,56.89) v2(98.55,55.94) v2(98.55,54.99) v2(98.59,19.03) v2(98.59,18.08) v2(98.59,17.12) v2(98.59,16.17) v2(98.85,23.21) v2(98.85,22.26) v2(98.85,21.31) v2(98.85,20.36) v2(99.01,48.92) v2(99.01,47.96) v2(99.01,47.01) v2(99.01,46.06) v2(99.01,44.58) v2(99.01,43.63) v2(99.01,42.68) v2(99.01,41.73) v2(98.96,40.25) v2(98.96,39.29) v2(98.96,38.34) v2(98.96,37.39) v2(98.97,31.57) v2(98.97,30.62) v2(98.97,29.66) v2(98.97,28.71) v2(98.96,27.55) v2(98.96,26.6) v2(98.96,25.64) v2(98.96,24.69) v2(99.11,66.36) v2(99.11,65.41) v2(99.11,64.46) v2(99.11,63.5) v2(99.11,61.97) v2(99.11,61.02) v2(99.11,60.07) v2(99.11,59.12) v2(99.06,35.91) v2(99.06,34.96) v2(99.06,34.01) v2(99.06,33.06) v2(99.21,83.8) v2(99.21,82.85) v2(99.21,81.9) v2(99.21,80.95) v2(99.16,79.36) v2(99.16,78.41) v2(99.16,77.46) v2(99.16,76.51) v2(99.21,70.49) v2(99.21,69.54) v2(99.21,68.59) v2(99.21,67.63) v2(99.16,13.37) v2(99.26,75.03) v2(99.26,74.08) v2(99.26,73.13) v2(99.26,72.17)
VIN_24V: length 12.5
  Top Layer w1.2: D1.2 28,20.2 C2.1 28.72,27.6
(no net):
  vias: v1(24.63,29.35) v1(24.66,31.27) v1(24.65,30.64) v1(24.66,30.03) v1(24.64,28.59) v1(25.3,31.27) v1(25.28,30.64) v1(25.3,30.03) v1(25.27,29.35) v1(25.28,28.59) v1(25.94,31.27) v1(25.92,30.64) v1(25.94,30.03) v1(25.91,29.35) v1(25.91,28.59) v1(26.57,31.27) v1(26.56,30.64) v1(26.57,30.03) v1(26.54,29.35) v1(26.55,28.59)
A_DIR_O: length 16.4
  Top Layer w0.4: 66.9,62.17 53.63,62.17 51.61,60.15 P37.2
A_EN_O: length 24
  Top Layer w0.4: U20.15 71.29,58.93 v2(71.09,58.73) ; P37.4 54.24,65.23 v2(55.69,63.78)
  Bottom Layer w0.4: v2(55.69,63.78) 60.74,58.73 v2(71.09,58.73)
A_STEP_O: length 15.6
  Top Layer w0.4: P37.3 52.76,62.69 52.89,62.82 66.9,62.82
B_DIR_O: length 9.5
  Top Layer w0.4: U20.8 60.72,55.03 58.49,52.81 P38.2
B_EN_O: length 9.3
  Top Layer w0.4: U20.6 60.05,56.33 58.49,57.89 P38.4
B_STEP_O: length 8.7
  Top Layer w0.4: U20.7 59.98,55.68 59.64,55.35 P38.3
ESP_BOOT: length 28.3
  Top Layer w0.4: U3.25 81.35,45.5 80.64,44.78 v2(79.72,44.78) ; Q4.3 66.03,29.16 v2(66.41,29.54)
  Bottom Layer w0.4: v2(66.41,29.54) 71.04,34.17 71.04,41.5 74.33,44.78 v2(79.72,44.78)
ESP_RST: length 65.4
  Top Layer w0.3: R18.1 70.78,27.19 Q5.3
  Top Layer w0.4: R18.1 76.32,25.39 78.04,23.67 93.41,23.67 v2(93.43,23.65) ; v2(96.14,48.25) 95.32,49.08 U3.3
  Bottom Layer w0.4: v2(93.43,23.65) 93.43,35.63 96.14,38.34 v2(96.14,48.25)
HOLD: length 29.5
  Top Layer w0.3: v2(91.25,20.87) 90.48,20.87 89.87,20.25 89.87,19.12
  Top Layer w0.4: U3.36 95.32,44.42 v2(94.82,43.92)
  Bottom Layer w0.3: v2(94.82,43.92) 94.82,39.28 92.06,36.52 92.06,21.68 v2(91.25,20.87)
I2S_BCK: length 28.8
  Top Layer w0.4: 75.53,63.38 75.53,63.48 79.15,67.1 82.21,67.1 83.89,65.42 U3.12 ; 75.53,63.38 75.44,63.47 72.63,63.47 ; 75.53,63.38 75.53,58.16 75.17,57.8 75.17,56.28 ; R75.1 75.17,56.28 ; 75.17,56.28 75.13,56.33 U20.11
I2S_DATA: length 19.3
  Top Layer w0.4: U3.10 86.43,66.01 83.79,68.65 77.85,68.65 74.62,65.42 72.63,65.42
I2S_MR#: length 19.1
  Top Layer w0.4: 72.63,62.82 71.56,62.82 70.38,61.64 70.38,56.36 71.04,55.7 ; 71.04,55.7 71.04,51.89 C28.2 71.49,49.61 70.64,48.75 R71.1 ; 71.04,55.7 71.06,55.68 U20.10
I2S_WS: length 27
  Top Layer w0.4: U20.12 73.57,56.98 74.87,58.27 v2(74.87,62.2) ; U3.11 85.16,65.83 83.16,67.84 78.11,67.84 v2(74.87,64.6) 74.39,64.12 72.63,64.12
  Bottom Layer w0.4: v2(74.87,62.2) v2(74.87,64.6)
M_EN_O: length 171.8
  Top Layer w0.4: H5.8 50.45,89.02 51.92,87.55 51.92,75.16 59.16,67.91 v2(65.13,67.91) ; H3.8 35.24,86.95 35.24,75.41 v2(40.14,70.52) ; 72.63,66.07 73.79,66.07 74.21,66.49 74.21,67.3 73.67,67.84 72.19,67.84 71.86,68.17 71.86,82.72 69.36,85.22 P31.4 ; P35.4 3.9,69.53 4.34,69.09 v2(16.37,69.09) ; H1.8 18.36,87.03 18.36,73.83 v2(23.1,69.09)
  Bottom Layer w0.4: P32.4 39.8,62.61 31.21,62.61 24.73,69.09 v2(23.1,69.09) v2(16.37,69.09) ; P32.4 47.48,64.55 v2(55.03,72.1) ; P32.4 41.74,68.91 v2(40.14,70.52) ; v2(65.13,67.91) v2(72.11,67.91)
PRE: length 14.1
  Top Layer w0.4: R20.1 89.31,71.13 v2(89.05,70.87) ; v2(85.68,70.16) 85.68,69.5 90.24,64.94 U3.7
  Bottom Layer w0.4: v2(89.05,70.87) 86.39,70.87 v2(85.68,70.16)
PROBE: length 21.7
  Top Layer w0.4: v2(90.84,77.83) R12.1 ; U3.8 88.97,65.39 84.86,69.5 84.86,73.98 v2(85.43,74.54)
  Bottom Layer w0.4: v2(90.84,77.83) 88.72,77.83 v2(85.43,74.54)
PWM: length 41.6
  Top Layer w0.4: U3.16 77.86,58.87 76.35,57.36 76.35,50.78 72.88,47.31 54.11,47.31 52.12,49.3 U5.2
QB: length 9.1
  Top Layer w0.4: v3(75.28,43.41) 75.69,43.82 81.81,43.82 82.62,44.62 U3.26
RX2: length 9.8
  Top Layer w0.4: R67.2 88.78,35.18 90.2,35.18 P23.2
RXD: length 46.6
  Top Layer w0.4: 56.87,26.26 56.87,29.18 58.98,31.28 v2(69.47,31.28) ; U3.34 92.78,44.52 89.83,41.57 87.49,41.57 v2(83.23,37.31)
  Bottom Layer w0.4: v2(83.23,37.31) 75.5,37.31 v2(69.47,31.28)
RXD2: length 26.6
  Top Layer w0.4: P15.2 76.46,42.13 81.5,42.13 83.89,44.52 U3.27 ; R67.1 86.75,35.17 v2(85.43,36.5)
  Bottom Layer w0.4: P15.2 76.07,39.35 82.57,39.35 v2(85.43,36.5)
SD_CD: length 44.9
  Top Layer w0.4: v2(75.31,30.43) 75.31,30.72 86.78,42.18 89.46,42.18 91.51,44.23 U3.33 ; R68.1 65.83,17.79 65.16,17.12 U8.9
  Bottom Layer w0.4: v2(75.31,30.43) 65.75,20.87 v2(65.75,17.65)
SD_CS: length 38.8
  Top Layer w0.4: R63.1 73.14,18.48 v2(73.14,17.14) 72.86,16.86 U8.2 ; v2(77.02,35.6) 77.41,35.6 86.43,44.62 U3.29
  Bottom Layer w0.4: v2(77.02,35.6) 77.02,21.02 v2(73.14,17.14)
SD_MISO: length 46.6
  Top Layer w0.4: U8.7 67.36,17.33 67.82,17.79 R66.1 ; U3.31 88.97,43.99 87.83,42.85 86.4,42.85 v2(75.08,31.52)
  Bottom Layer w0.4: v2(75.08,31.52) 64.78,21.22 64.78,17.45 65.75,16.48 v2(67.38,16.48)
SD_MOSI: length 50.2
  Top Layer w0.4: R64.1 71.34,17.69 71.76,17.27 U8.3 ; U3.37 96.59,44.42 v2(91.04,38.87)
  Bottom Layer w0.4: v2(91.04,38.87) 91.04,25 82.27,16.22 v2(71.82,16.22)
SD_SCLK: length 39.5
  Top Layer w0.4: v2(76.2,33.97) 76.71,33.97 86.35,43.61 86.92,43.61 87.7,44.4 U3.30 ; U8.5 69.56,16.22 v2(69.62,16.28)
  Bottom Layer w0.4: v2(76.2,33.97) 76.2,22.85 v2(69.62,16.28)
SPN_PWM: length 79.7
  Top Layer w0.4: 2.7,29.82 4.84,27.67 4.84,18.76 2.7,16.62 P19.3 ; 2.7,29.82 P20.2 ; 2.7,29.82 9.54,29.82 12.9,33.18 17.29,33.18 22.59,38.49 34.53,38.49 36.72,40.68 R39.1
  Top Layer w0.6: 42.13,52.61 36.71,52.61 DZ2.2 36.27,51.47 36.77,50.97 R44.1 36.77,43.33 R39.1 R37.1 R38.1
SPN_PWM_OUT: length 3.3
  Top Layer w0.6: R44.2 32.03,43.97 Q3.1
START: length 18.1
  Top Layer w0.4: R19.1 75.6,70.81 77.11,69.29 84.15,69.29 87.7,65.74 U3.9
SW1: length 63.3
  Top Layer w0.4: R83.2 25.3,37.69 v2(25.3,37.87) ; v2(77.27,47.41) 78.39,48.53 78.39,49.45 78.91,49.98 U3.23
  Bottom Layer w0.4: v2(77.27,47.41) 56.87,47.41 50.34,40.88 28.31,40.88 v2(25.3,37.87)
SW2: length 29.4
  Top Layer w0.4: v2(56.13,43.46) 56,43.33 U6.2 ; v2(77.16,46.44) 79.1,46.44 80.35,47.69 U3.24
  Bottom Layer w0.4: v2(56.13,43.46) 59.21,46.54 77.06,46.54 v2(77.16,46.44)
SW2_OUT: length 2.6
  Top Layer w0.4: U6.4 v3(48.4,44.28)
TX2: length 9.5
  Top Layer w0.4: P23.3 95.49,31.84 90.17,37.16 88.83,37.16 R65.2
TXD: length 45.9
  Top Layer w0.4: R61.2 58.76,29.18 60.09,30.5 70.49,30.5 v2(70.8,30.81) ; v2(82.42,36.34) 83.18,36.34 87.07,40.23 89.47,40.23 94.05,44.81 U3.35
  Bottom Layer w0.4: v2(82.42,36.34) 76.33,36.34 v2(70.8,30.81)
TXD2: length 22.1
  Top Layer w0.4: v2(85.99,38.13) 86.16,38.13 R65.1 ; U3.28 85.16,44.31 81.4,40.55 P15.3
  Bottom Layer w0.4: P15.3 83.56,40.55 v2(85.99,38.13)
USB_DM: length 8.2
  Top Layer w0.4: U9.3 44.91,16.14 44.2,15.43 44.2,12.71
USB_DP: length 13
  Top Layer w0.4: U9.1 45.33,18.04 42.8,15.51 42.8,12.12 44.2,10.71
VUSB: length 16.7
  Top Layer w0.4: U9.5 51.52,17.09 50.8,16.38 50.8,14.64 48.87,12.71 P22.1
  Top Layer w0.6: v2(40.81,14.69) 40.81,16.42
  Bottom Layer w0.6: v2(40.81,14.69) 44.72,14.69 P22.1
X_1A: length 25
  Top Layer w0.6: 29.5,78.86 28.33,77.69 26.95,77.69
  Bottom Layer w1: P10.3 19.19,89.16 29.5,78.86
X_1B: length 28.2
  Top Layer w0.6: 26.95,75.89 29.07,75.89 29.5,76.32
  Bottom Layer w1: P10.4 16.65,94.51 17.91,93.26 17.91,87.91 29.5,76.32
X_2A: length 21.7
  Top Layer w0.6: 29.5,81.4 27.59,79.49 26.95,79.49
  Bottom Layer w1: P10.2 21.73,89.16 29.5,81.4
X_2B: length 18.4
  Top Layer w0.6: 29.5,83.94 26.95,81.39 26.95,81.29
  Bottom Layer w1: 29.5,83.94 24.27,89.16 P10.1
X_DIR_O: length 69.1
  Top Layer w0.4: P35.2 13.2,74.61 v2(13.21,74.6) ; H1.1 20.51,67.1 53.76,67.1 57.38,63.47 66.9,63.47
  Bottom Layer w0.4: v2(13.21,74.6) 13.21,74.4 H1.1
X_LIMT: length 27.2
  Top Layer w0.3: R2.2 79.06,81.78 79.06,79.82 81.61,77.27 84.41,77.27 86.4,75.28 86.4,69.57 91.51,64.46 U3.6
X_LIMT_I: length 18.5
  Top Layer w0.4: P1.1 71.2,97.15 74.52,93.83 74.52,86.75 76.35,84.92 R1.1 R2.1 76.35,81.78 76.36,81.77 C1.2
X_STEP_O: length 69.3
  Top Layer w0.4: 16.17,73.78 22.04,67.91 54.04,67.91 57.84,64.12 66.9,64.12 ; 16.17,73.78 H1.2 ; 16.17,73.78 14.64,73.78 12.92,72.07 P35.3
Y_1A: length 44.8
  Top Layer w0.6: H4.4 44.81,77.7 R22.1
  Top Layer w1: P9.3 32.56,97.08 34.07,98.59 47.49,98.59 48.47,97.61 P13.2
  Bottom Layer w1: P9.3 32.56,94.8 41.01,86.35 41.01,83.82 H4.4
Y_1B: length 54.1
  Top Layer w0.6: H4.3 45.55,75.89 R21.1
  Bottom Layer w1: P13.1 51.01,97.37 49.55,98.82 31.35,98.82 30.02,97.49 P9.4 30.02,95.1 39.58,85.53 39.58,81.61 44.87,76.32 H4.3
Y_2A: length 40.2
  Top Layer w0.6: R24.1 44.07,79.5 H4.5
  Bottom Layer w1: P9.2 35.1,94.44 42.39,87.15 42.39,84.46 45.45,81.4 H4.5 46.51,81.4 47.9,82.78 47.9,92.22 45.93,94.18 P13.3
Y_2B: length 26
  Top Layer w0.6: R26.1 43.5,81.46 H4.6
  Bottom Layer w1: H4.6 45.06,83.94 44.12,84.87 44.12,87.52 37.64,94.01 P9.1 P13.4
Y_DIR_O: length 41.2
  Top Layer w0.4: H3.1 33.17,71 35.55,68.63 v2(38.05,68.63) 54.31,68.63 58.17,64.77 66.9,64.77
  Bottom Layer w0.4: P32.2 36.66,67.24 v2(38.05,68.63)
Y_LIMT: length 24.4
  Top Layer w0.3: U3.5 92.78,64.26 87.01,70.03 87.01,75.84 83.44,79.41 83.44,81.63 R5.2
Y_LIMT_I: length 17.6
  Top Layer w0.4: C4.2 80.64,94.31 77.8,97.15 P2.1
Y_STEP_O: length 42
  Top Layer w0.4: 66.9,65.42 58.54,65.42 54.67,69.29 37.66,69.29 H3.2
  Bottom Layer w0.4: P32.3 v2(39.2,69.39)
Z_1A: length 21.8
  Top Layer w0.6: H6.4 62.02,77.99 R29.1
  Bottom Layer w1: H6.4 59.29,82.46 P12.3
Z_1B: length 25.1
  Top Layer w0.6: H6.3 60.75,76.32 R27.1
  Bottom Layer w1: H6.3 56.75,82.46 P12.4
Z_2A: length 19.3
  Top Layer w0.6: R31.1 61.31,79.82 H6.5
  Bottom Layer w1: P12.2 61.83,92.43 60.9,91.5 60.9,83.39 H6.5
Z_2B: length 16.6
  Top Layer w0.6: R32.1 60.61,81.65 H6.6
  Bottom Layer w1: P12.1 64.62,96.26 64.62,85.67 H6.6
Z_DIR_O: length 36.4
  Top Layer w0.4: P31.2 68.86,80.14 67.07,78.35 67.07,72.76 68.8,71.03 68.8,66.7 68.17,66.07 58.71,66.07 53.54,71.24 H5.1
Z_LIMT: length 23.1
  Top Layer w0.3: R9.2 86.41,82.87 87.88,81.4 87.88,70.54 94.05,64.37 U3.4
Z_LIMT_I: length 18.3
  Top Layer w0.4: C11.2 84.83,87.78 87.12,90.07 87.12,94.2 84.17,97.15 P3.1
Z_STEP_O: length 37.6
  Top Layer w0.4: P31.3 68.86,82.68 66.05,79.87 66.05,70.62 66.9,69.76 66.9,66.72 59.08,66.72 52.02,73.78 H5.2
$9N72390: length 10.5
  Top Layer w0.8: D2.2 33.97,23.17 L1.2 31,29.26 U1.2
$9N72392: length 2.8
  Top Layer w0.6: R7.1 28.52,32.07 U1.4
$9N72730: length 2.1
  Top Layer w0.4: D3.1 23.6,6.23 R3.1
$9N85313: length 3.4
  Top Layer w0.4: U3.13 82.62,64.5 v3(81.29,65.82)
$9N85316: length 3.1
  Top Layer w0.4: U3.14 79.88,64.4 v3(78.85,64.4)
$9N85928: length 7.8
  Top Layer w0.3: C23.1 53.39,21.14 53.97,20.57 53.97,16.07 54.61,15.43 55.41,15.43
$9N85949: length 6
  Top Layer w0.3: U9.6 52.71,18.04 53.3,17.45 53.3,15.59 54.73,14.16 55.41,14.16
$9N85958: length 5
  Top Layer w0.3: 55.41,12.89 54.73,12.89 52.15,15.47 U9.4
$9N85962: length 12.6
  Top Layer w0.3: Y1.2 60.3,6.48 58.35,8.43 58.35,10.67 57.4,11.62 55.41,11.62
  Top Layer w0.4: C24.1 61.05,3.41 Y1.2
$9N85965: length 7.3
  Top Layer w0.3: Y1.1 55.41,6.52 55.41,10.35
  Top Layer w0.4: C25.1 55.45,3.36 Y1.1
$9N86544: length 8.3
  Top Layer w0.3: R60.1 56.87,22.5 57.54,21.83 57.54,18.83 56.68,17.97 U7.2
$9N86546: length 9.7
  Top Layer w0.3: U7.3 56.64,16.7 58.35,18.42 58.35,23.4 58.76,23.8 R61.1
$9N86982: length 16.7
  Top Layer w0.3: Q4.2 66.44,27.16 66.92,26.68 66.92,24.13 66.32,23.53 R69.1 65.59,22.8 64.32,21.53 64.32,16.73 63.02,15.43 U7.13
$9N86987: length 15.1
  Top Layer w0.3: Q5.2 67.63,25.66 v2(67.63,25.41) ; U7.14 62.65,16.7 63.6,17.65 v2(63.6,22.29) R62.1
  Bottom Layer w0.3: v2(67.63,25.41) 64.52,22.29 v2(63.6,22.29)
$9N88605: length 4.8
  Top Layer w0.4: R43.2 44.05,55.01 Q2.1 43.2,55.08 R36.1
$9N88716: length 2.2
  Top Layer w0.4: D8.1 16,37.46 R34.1
$9N88747: length 46.5
  Top Layer w0.4: D8.2 16.19,39.02 21.39,44.23 Q3.4
  Top Layer w2: D9.2 21.39,47.77 Q3.4
  Top Layer w2.5: Q3.4 18.47,49.49 DZ1.1 12.86,51.06 11.33,52.59 v2(11.33,52.69)
  Bottom Layer w2.5: 4.34,61.21 7.66,61.21 11.33,57.54 v2(11.33,52.69)
  vias: v2(10.92,52.02) v2(11.69,51.92) v2(12.2,52.64) v2(18.37,44.53) v2(18.37,43.58) v2(18.37,42.63) v2(18.37,41.67) v2(18.48,51.26) v2(18.48,50.31) v2(18.48,49.36) v2(18.48,48.41) v2(18.48,47.44) v2(18.48,46.49) v2(18.48,45.53) v2(19.29,45.04) v2(19.29,44.09) v2(19.29,43.14) v2(19.29,42.18) v2(19.39,51.77) v2(19.39,50.82) v2(19.39,49.87) v2(19.39,48.92) v2(19.39,47.95) v2(19.39,47) v2(19.39,46.04) v2(20.26,44.58) v2(20.26,43.63) v2(20.26,42.68) v2(20.26,41.73) v2(20.36,51.31) v2(20.36,50.36) v2(20.36,49.41) v2(20.36,48.46) v2(20.36,47.49) v2(20.36,46.54) v2(20.36,45.58) v2(21.28,45.04) v2(21.28,44.09) v2(21.28,43.14) v2(21.28,42.18) v2(21.38,51.77) v2(21.38,50.82) v2(21.38,49.87) v2(21.38,48.92) v2(21.38,47.95) v2(21.38,47) v2(21.38,46.04) v2(22.25,44.58) v2(22.25,43.63) v2(22.25,42.68) v2(22.25,41.73) v2(22.35,51.31) v2(22.35,50.36) v2(22.35,49.41) v2(22.35,48.46) v2(22.35,47.49) v2(22.35,46.54) v2(22.35,45.58) v2(23.12,44.99) v2(23.12,44.04) v2(23.12,43.09) v2(23.12,42.13) v2(23.22,51.72) v2(23.22,50.77) v2(23.22,49.82) v2(23.22,48.87) v2(23.22,47.9) v2(23.22,46.94) v2(23.22,45.99) v2(24.11,44.58) v2(24.11,43.62) v2(24.11,42.67) v2(24.11,41.72) v2(24.22,51.31) v2(24.22,50.36) v2(24.22,49.4) v2(24.22,48.45) v2(24.22,47.48) v2(24.22,46.53) v2(24.22,45.58)
$9N89002: length 4
  Top Layer w0.4: 45.37,52.09 45.39,52.07 R48.2 ; 45.37,52.09 U5.4 ; 45.37,52.09 R43.1
$9N89334: length 2
  Top Layer w0.3: 63.6,25.13 63.62,25.15 Q4.1
$9N89338: length 4.8
  Top Layer w0.3: 65.59,25.13 65.59,25.41 v2(66.26,26.07) ; Q5.1 v2(67.02,28.14)
  Bottom Layer w0.3: v2(67.02,28.14) 67.02,26.83 v2(66.26,26.07)
$9N90234: length 2.5
  Bottom Layer w0.8: 16.17,78.86 16.17,76.32
$9N91167: length 2.5
  Bottom Layer w0.8: H3.4 H3.3
$9N91379: length 2.5
  Bottom Layer w0.8: H5.4 H5.3
$9N98710: length 32.1
  Top Layer w0.4: K1.3 82.78,5.27 84.06,3.98 P7.1 ; K1.3 79.62,18.23 79.31,18.54 ; K1.3 82.78,20 80.08,22.7 73.67,22.7 R18.2
$9N100309: length 11.8
  Top Layer w0.4: R16.2 73.27,71.89 75.37,73.99 C15.2 77.2,73.75 R19.2 77.22,71.87 P8.1
$9N100484: length 10.9
  Top Layer w0.4: C12.2 89.09,83.45 R11.2 89.05,83.36 90.84,81.57 R12.2 90.91,80.9 P4.1
$9N100628: length 9.2
  Top Layer w0.4: R20.2 91.08,73.69 C16.2 91.15,71.79 R17.2 91.48,71.46 P6.1
$9N100772: length 9.6
  Top Layer w0.4: R13.2 89.87,15.19 89.87,17.52 91.67,17.52 C13.2 93.5,15.77 P5.1
$9N100840: length 2
  Top Layer w0.4: R10.1 58.41,42.4 D7.1
$9N100955: length 2.2
  Top Layer w0.4: D5.1 47.38,22.62 R6.1
$9N120731: length 6.4
  Top Layer w0.4: U20.14 73.65,58.28 74.15,58.78 74.15,61.64 73.62,62.17 72.63,62.17
$9N121473: length 2
  Top Layer w0.4: 24.12,14.35 D12.1
$9N121474: length 31
  Top Layer w0.4: D12.2 v2(21.22,16.05) ; 14.59,17.91 18,14.5 v2(18,14.47)
  Top Layer w0.8: C32.2 14.59,17.91 Q1.2
  Top Layer w1: H11.1 13.68,12.06 C32.2 14.59,6.27 16.38,4.48 P40.1
  Bottom Layer w0.4: v2(21.22,16.05) 21.22,14.87 20.76,14.41 18.05,14.41 v2(18,14.47)
$9N121477: length 8.3
  Top Layer w0.8: 18.42,25.02 18.37,25.07 16.43,25.07 16.63,25.28 16.63,30.2 R81.2
$9N121478: length 3.4
  Top Layer w0.6: 19.33,22.46 19.33,19.35 R82.1
$9N121481: length 12.1
  Top Layer w0.4: R83.1 21.95,34.68 19.69,32.42 19.69,25.66 20.3,25.05 Q7.1

## Copper pours and planes (outline as drawn; the poured copper is in the pictures)
GND on Top Layer: -1.95,101.84 102.3,101.84 102.3,-2.41 -1.95,-2.41
GND on Bottom Layer: -2.66,102.35 101.58,102.35 101.58,-1.9 -2.66,-1.9

Small or netless copper shapes (teardrops, artwork), in the pictures only: 479 on Top Layer, 128 on Bottom Layer

## Text on the board
Top Silkscreen Layer: 5V | DIR | CLK | EN | MOTOR | Y1-MOTOR | Y2-MOTOR | X_LIMIT | Y_LIMIT | Reset | Z_LIMIT | GND | LIMIT | PWM1 | 24V | PWM | RX | TX | Start | Pre | test | Probe | 48V_SPN- | 48V_SPN+ | SW1 | RX0 | TX0 | 20250821
